# EAGLE design KarasolboxCont (EAGLE 8.1.1)
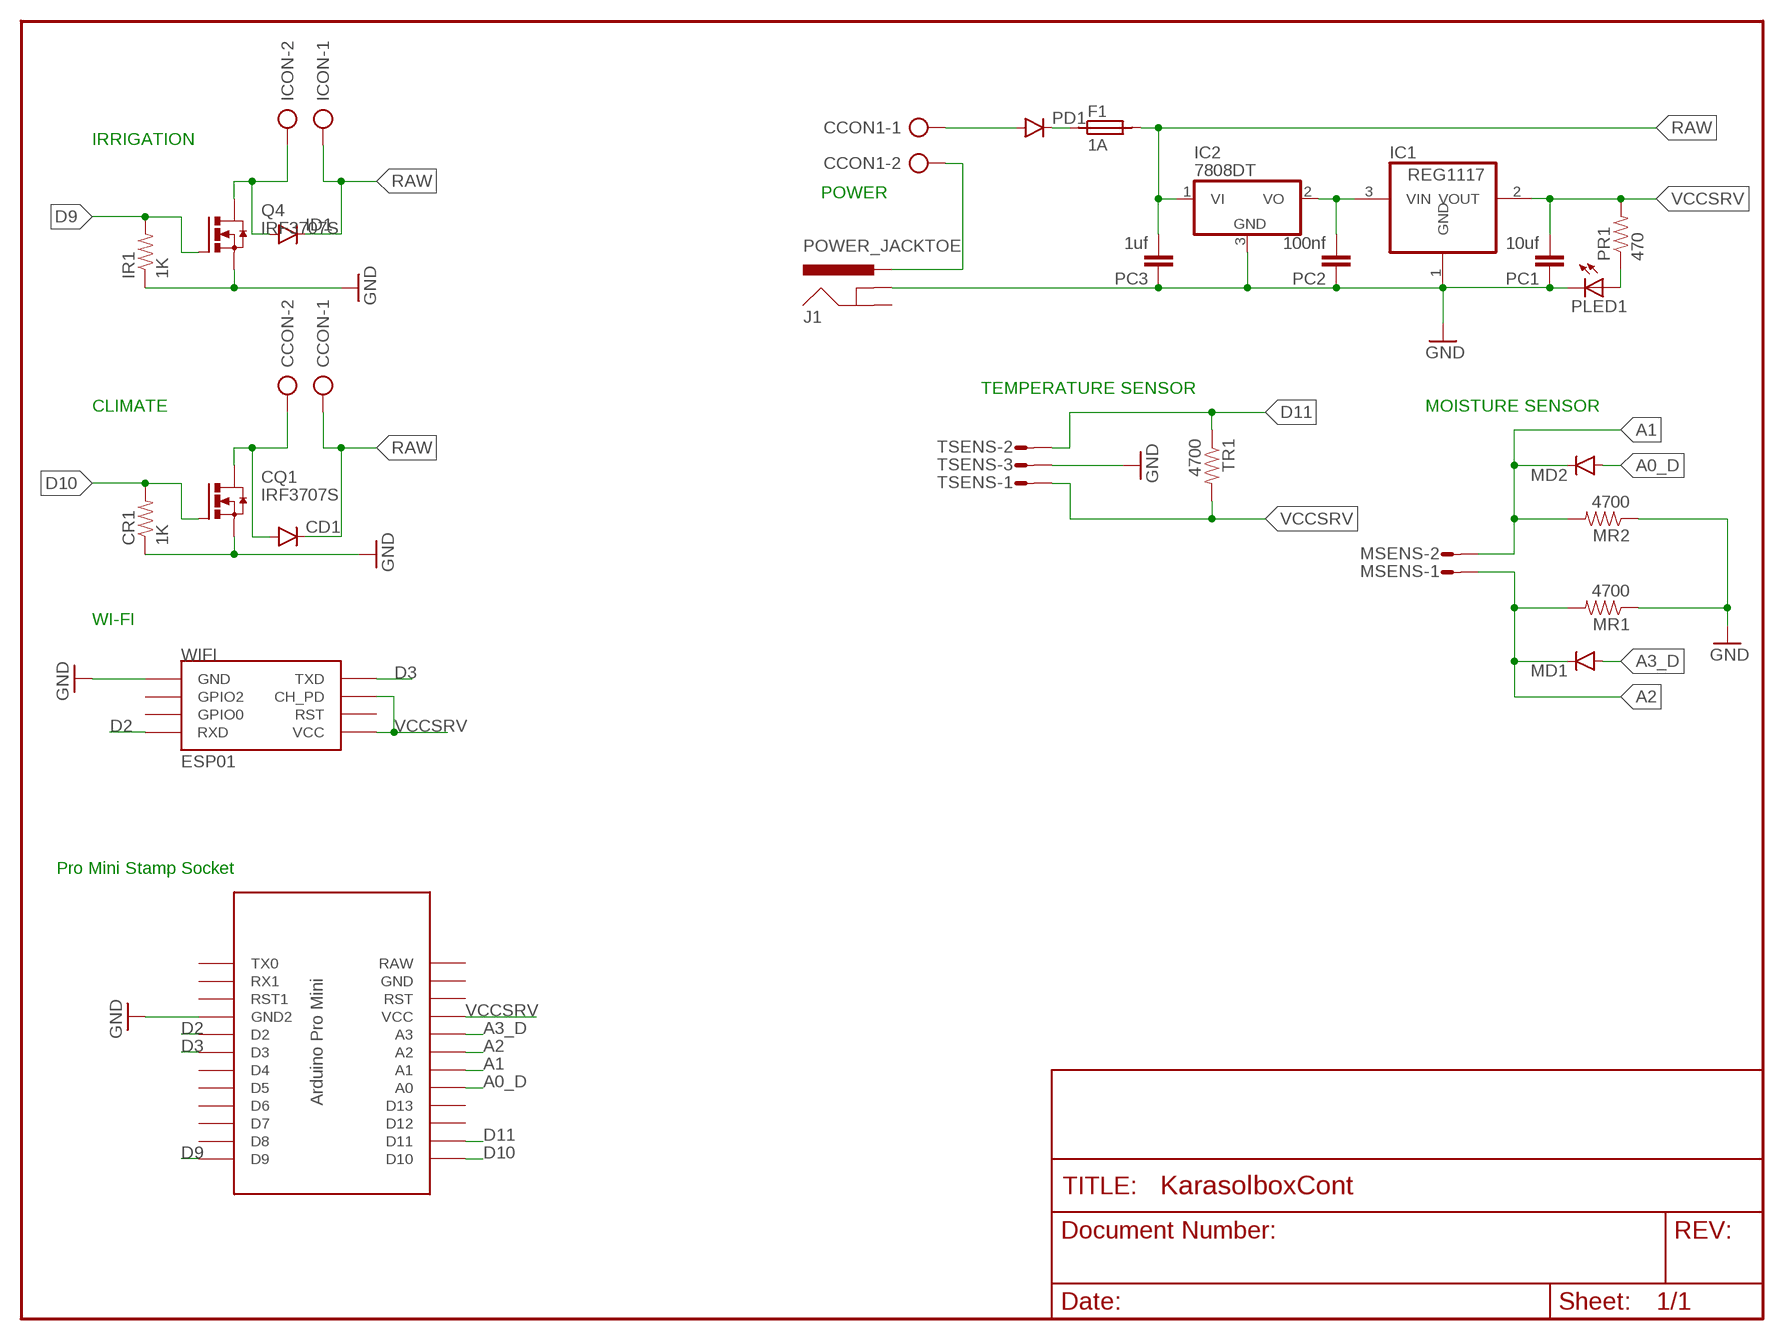
[diagram p0: schematic, sheet 1]

## Parts
CCON  AK300/2  [AK300/2]
CCON1  AK300/2  [AK300/2]
CD1  DIODESMA  [SMA-DIODE]
CQ1  IRF3707S  IRF3704S  [D2PACK]
CR1  1K  RESISTOR0805-RES  [0805]
F1  1A  SIBA194600  [1820]
IC1  REG1117  [SOT223]
IC2  7808DT  [TO252]
ICON  AK300/2  [AK300/2]
ID1  DIODESMA  [SMA-DIODE]
IR1  1K  RESISTOR0805-RES  [0805]
J1  POWER_JACKTOE  [POWER_JACK_SMD_OVERPASTE_TOE]
MD1  DIODESMA  [SMA-DIODE]
MD2  DIODESMA  [SMA-DIODE]
MR1  4700  RESISTOR0805-RES  [0805]
MR2  4700  RESISTOR0805-RES  [0805]
MSENS  S02P  [S02P]
PC1  10uf  CAP0805  [0805]
PC2  100nf  CAP0805  [0805]
PC3  1uf  CAP0805  [0805]
PD1  DIODESMA  [SMA-DIODE]
PLED1  LEDCHIP-LED0805  [CHIP-LED0805]
PR1  470  RESISTOR0805-RES  [0805]
Q4  IRF3707S  IRF3704S  [D2PACK]
TR1  4700  RESISTOR0805-RES  [0805]
TSENS  S03P  [S03P]
U$1  ABK-PRO-MINI  [ABK-PRO-MINI]
WIFI  ESP01  [ESP01]

## Nets
A0_D: MD2.A U$1.A0
A1: MD2.C MR2.2 MSENS.2 U$1.A1
A2: MD1.C MR1.2 MSENS.1 U$1.A2
A3_D: MD1.A U$1.A3
D2: U$1.D2 WIFI.RX(RXD)
D3: U$1.D3 WIFI.TX(TXD)
D9: IR1.2 Q4.1(G) U$1.D9
D10: CQ1.1(G) CR1.2 U$1.D10
D11: TR1.1 TSENS.2 U$1.D11
GND: CQ1.3(S) CR1.1 IC1.1(GND) IC2.3(GND) IR1.1 J1.GND(GNDBREAK) MR1.1 MR2.1 PC1.1 PC2.1 PC3.1 PLED1.C Q4.3(S) TSENS.3 U$1.GND1(GND2) WIFI.GND
N$1: F1.1 PD1.C
N$2: CCON.2 CD1.A CQ1.2(D)
N$3: CCON1.1 PD1.A
N$5: ICON.2 ID1.A Q4.2(D)
N$7: CCON1.2 J1.VIN0(PWR)
N$11: PLED1.A PR1.1
N$12: IC1.3(VIN) IC2.2(VO) PC2.2
RAW [v]: CCON.1 CD1.C F1.2 IC2.1(VI) ICON.1 ID1.C PC3.2
VCCSRV: IC1.2(VOUT) PC1.2 PR1.2 TR1.2 TSENS.1 U$1.VCC WIFI.CH_PD WIFI.VCC
Unconnected: J1.P$4(GND) U$1.D4 U$1.D5 U$1.D6 U$1.D7 U$1.D8 U$1.D12 U$1.D13 U$1.GND U$1.RAW U$1.RST U$1.RST1 U$1.RX1 U$1.TX0 WIFI.GPIO0 WIFI.GPIO2 WIFI.RST

## Notes on the sheet
- IRRIGATION
- POWER
- TEMPERATURE SENSOR
- CLIMATE | MOISTURE SENSOR
- WI-FI
- Pro Mini Stamp Socket

## Library data of the parts
CCON CCON1 ICON = con-ptr500:AK300/2: CONNECTOR; OC_FARNELL: unknown; OC_NEWARK: unknown
CD1 ID1 MD1 MD2 PD1 = SparkFun-DiscreteSemi:DIODE: Diode These are standard reverse protection diodes and small signal diodes. SMA package can handle up to about 1A. SOD-323 can handle about 200mA. What the SOD-323 package when ordering, there are some mfgs out there that are 5-pin packages.
CQ1 Q4 = transistor-power:IRF3704: SMPS MOSFET HEXFET® Power MOSFET Source: http://www.irf.com/product-info/datasheets/data/irf3704.pdf
CR1 IR1 MR1 MR2 PR1 TR1 = SparkFun-Passives:RESISTOR: Resistor Basic schematic elements and footprints for 0603, 1206, and PTH resistors.
F1 = _hhn_PtcFuses_Siba_r500_Ozan:SIBA194600*: SIBA PTC-Fuses, Series 194600, 1812 (4.5 3.2)mm Source: www.siba.de/ Package: SMD 1812 (4.5 x 3.2)mm Technologies: SIBA194600Axxx xxx: Trip-Current * 10 mA Author: Dipl.-Ing. FH Rainer Bayer
IC1 = burr-brown:REG1117: 800mA and 1A Low Dropout (LDO) Positive Regulator 1.8V, 2.5V, 2.85V, 3.3V, 5V, and Adj; MPN: REG1117; OC_FARNELL: 1097566; OC_NEWARK: 14P6981
IC2 = linear:78*: Positive VOLTAGE REGULATOR Source: http://cache.national.com/ds/LM/LM78L05.pdf http://www.fairchildsemi.com/ds/LM/LM7805.pdf
J1 = SparkFun-Connectors:POWER_JACK: Power Jack Connector This is the standard 5.5mm barrel jack for power. The PTH is the most common, proven, reliable, footprint. The Slot footprint only works if the mill layer is transmitted to the PCB fab house so be warned. Here are the connectors we sell at SparkFun: DC Barrel Power Jack/Connector <https://www.sparkfun.com/products/119> (PRT-00119) DC Barrel Power Jack/Connector (SMD) <https://www.sparkfun.com/products/12748> (PRT-12748) DC Barrel Jack Adapter - Breadboard Compatible <https://www.sparkfun.com/products/10811> (PRT-10811) It is used on this SparkFun product (and many, many others): SparkFun RedBoard - Programmed with Arduino <https://www.sparkfun.com/products/12757> (DEV-12757) Also, if you need a mating power supply or connector, please check these out: Wall Adapter Power Supply - 9VDC 650mA <https://www.sparkfun.com/products/298> (TOL-00298) DC Barrel Jack Adapter - Male <https://www.sparkfun.com/products/10287> (PRT-10287); PROD_ID: CONN-08106; SF_ID: PRT-12748
MSENS = con-amp-mt:S02P: AMP MT CONNECTOR; OC_FARNELL: unknown; OC_NEWARK: unknown
PC1-PC3 = SparkFun-Capacitors:CAP: Capacitor Standard 0603 ceramic capacitor, and 0.1" leaded capacitor.
PLED1 = led:LED: LED OSRAM: - CHIPLED LG R971, LG N971, LY N971, LG Q971, LY Q971, LO R971, LY R971 LH N974, LH R974 LS Q976, LO Q976, LY Q976 LO Q996 - Hyper CHIPLED LW Q18S LB Q993, LB Q99A, LB R99A - SideLED LS A670, LO A670, LY A670, LG A670, LP A670 LB A673, LV A673, LT A673, LW A673 LH A674 LY A675 LS A676, LA A676, LO A676, LY A676, LW A676 LS A679, LY A679, LG A679 - Hyper Micro SIDELED® LS Y876, LA Y876, LO Y876, LY Y876 LT Y87S - SmartLED LW L88C, LW L88S LB L89C, LB L89S, LG L890 LS L89K, LO L89K, LY L89K LS L896, LA L896, LO L896, LY L896 - TOPLED LS T670, LO T670, LY T670, LG T670, LP T670 LSG T670, LSP T670, LSY T670, LOP T670, LYG T670 LG T671, LOG T671, LSG T671 LB T673, LV T673, LT T673, LW T673 LH T674 LS T676, LA T676, LO T676, LY T676, LB T676, LH T676, LSB T676, LW T676 LB T67C, LV T67C, LT T67C, LS T67K, LO T67K, LY T67K, LW E67C LS E67B, LA E67B, LO E67B, LY E67B, LB E67C, LV E67C, LT E67C LW T67C LS T679, LY T679, LG T679 LS T770, LO T770, LY T770, LG T770, LP T770 LB T773, LV T773, LT T773, LW T773 LH T774 LS E675, LA E675, LY E675, LS T675 LS T776, LA T776, LO T776, LY T776, LB T776 LHGB T686 LT T68C, LB T68C - Hyper Mini TOPLED® LB M676 - Mini TOPLED Santana® LG M470 LS M47K, LO M47K, LY M47K Source: http://www.osram.convergy.de LUXEON: - LUMILED® LXK2-PW12-R00, LXK2-PW12-S00, LXK2-PW14-U00, LXK2-PW14-V00 LXK2-PM12-R00, LXK2-PM12-S00, LXK2-PM14-U00 LXK2-PE12-Q00, LXK2-PE12-R00, LXK2-PE12-S00, LXK2-PE14-T00, LXK2-PE14-U00 LXK2-PB12-K00, LXK2-PB12-L00, LXK2-PB12-M00, LXK2-PB14-N00, LXK2-PB14-P00, LXK2-PB14-Q00 LXK2-PR12-L00, LXK2-PR12-M00, LXK2-PR14-Q00, LXK2-PR14-R00 LXK2-PD12-Q00, LXK2-PD12-R00, LXK2-PD12-S00 LXK2-PH12-R00, LXK2-PH12-S00 LXK2-PL12-P00, LXK2-PL12-Q00, LXK2-PL12-R00 Source: www.luxeon.com KINGBRIGHT: KA-3528ASYC Source: www.kingbright.com
TSENS = con-amp-mt:S03P: AMP MT CONNECTOR; OC_FARNELL: unknown; OC_NEWARK: unknown
U$1 = Arduino-Clk:ABK-PRO-MINI: ABK Pro-Mini Arduino Clone
WIFI = esp8266modules:ESP01: ESP8266 Wifi module 01

## Net classes
0 default: width 0.3 mm, drill 0.5 mm, clearance 0.25 mm

## Board
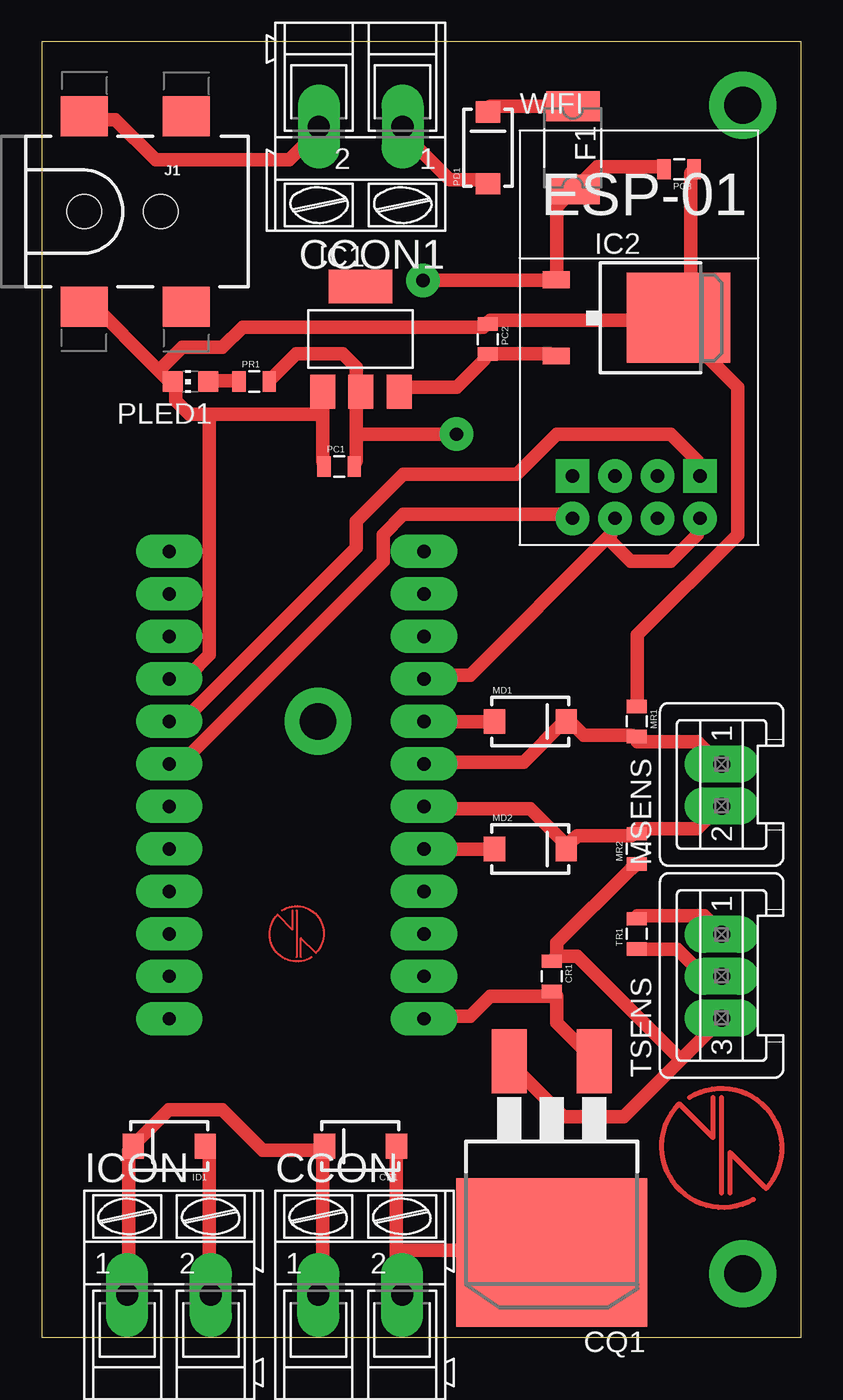
[diagram p1: board, top side]
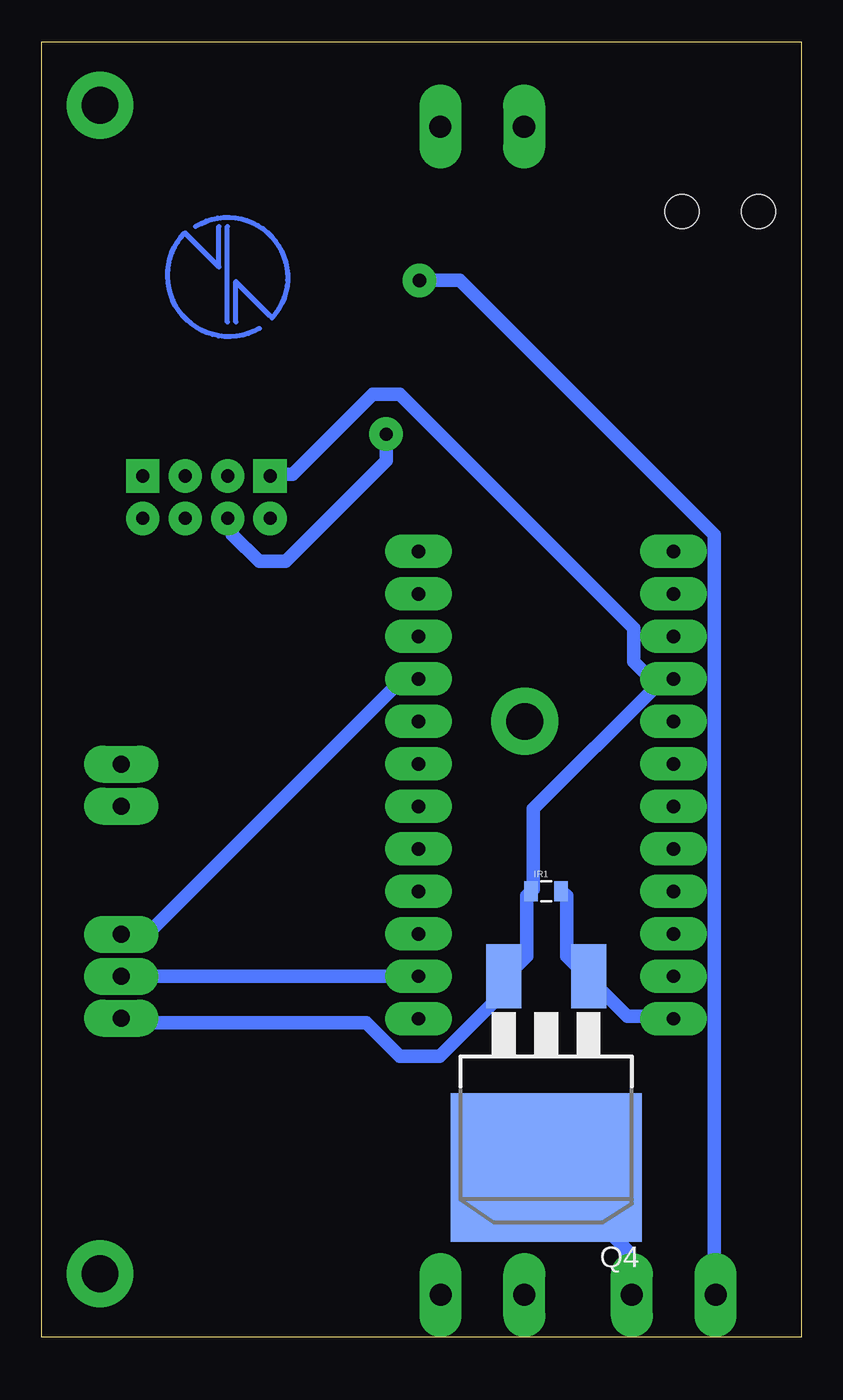
[diagram p2: board, bottom side, seen from below]

Size 45.39 x 77.46 mm. Coordinates in mm from the lower left corner, seen from the top.
Outline: 0,0 45.39,0 45.39,77.46 0,77.46 0,0
Copper layers (1*16): Top 0.035mm / dielectric 1.5mm / Bottom 0.035mm
Design rules "default *": minimum track width 0.8mm, minimum drill 0.8mm, track to track 0.8mm, track to pad 0.8mm, pad to pad 0.45mm, via to via 0.8mm, smd to smd 8mil, copper to edge 40mil, drill to drill 8mil, minimum pad ring 0.6mm, minimum via ring 0.6mm, stop-mask expansion 4mil, vias tented up to drill 0mil, thermal gap 10mil

### Footprints (pad centres in the part's own frame; a part is rotated, then mirrored left to right if it is on the bottom)
AK300/2 = drill 1.321 long: 1 -2.515,0; 2 2.489,0
SMA-DIODE = smd 1.27 x 1.47: A -2.15,0; C 2.15,0
D2PACK = smd 2.083 x 3.81: 1 -2.54,-8.89; 3 2.54,-8.89 | smd 11.43 x 8.89: 2 0,2.54
0805 = smd 0.8 x 1.2: 1 -0.9,0; 2 0.9,0
1820 = smd 1.78 x 3.2: 1 -2.49,0; 2 2.49,0
SOT223 = smd 1.499 x 2.007: 1 -2.261,-3.15; 2 0.025,-3.15; 3 2.311,-3.15 | smd 3.81 x 2.007: 4 0,3.15
TO252 = smd 1 x 1.6: 1 -2.28,-4.8; 2 2.28,-4.8 | smd 5.4 x 6.2: 3 0,2.5
POWER_JACK_SMD_OVERPASTE_TOE = smd 2.8 x 2.4: GND 0,-5.7; P$4 6.1,-5.7; VIN0 0,5.7; VIN1 6.1,5.7 | hole 2.032: 0,0; 4.572,0
S02P = drill 1.016 long: 1 1.25,0; 2 -1.25,0
CHIP-LED0805 = smd 1.2 x 1.2: A 0,-1.05; C 0,1.05
S03P = drill 1.016 long: 1 2.5,0; 2 0,0; 3 -2.5,0
ABK-PRO-MINI = drill 0.8 long: A0 10.16,-11.43; A1 10.16,-8.89; A2 10.16,-6.35; A3 10.16,-3.81; D2 -5.08,-3.81; D3 -5.08,-6.35; D4 -5.08,-8.89; D5 -5.08,-11.43; D6 -5.08,-13.97; D7 -5.08,-16.51; D8 -5.08,-19.05; D9 -5.08,-21.59; D10 10.16,-21.59; D11 10.16,-19.05; D12 10.16,-16.51; D13 10.16,-13.97; GND 10.16,3.81; GND1 -5.08,-1.27; RAW 10.16,6.35; RST 10.16,1.27; RST1 -5.08,1.27; RX1 -5.08,3.81; TX0 -5.08,6.35; VCC 10.16,-1.27
ESP01 = drill 0.8: CH_PD -1.285,-8.178; GPIO0 1.255,-5.638; GPIO2 -1.285,-5.638; RST 1.255,-8.178; TX -3.825,-8.178; VCC 3.795,-8.178 | drill 0.8 square: GND -3.825,-5.638; RX 3.795,-5.638

### Placement (x,y rotation side)
CCON  19.05,2.54 0 top
CCON1  19.05,72.39 180 top
CD1  19.05,11.43 180 top
CQ1  30.48,7.62 180 top
CR1  30.48,21.59 270 top
F1  31.75,71.12 270 top
IC1  19.05,59.69 0 top
IC2  35.56,60.96 270 top
ICON  7.62,2.54 0 top
ID1  7.62,11.43 180 top
IR1  15.24,26.67 0 bottom
J1  2.54,67.31 0 top
MD1  29.21,36.83 0 top
MD2  29.21,29.21 0 top
MR1  35.56,36.83 270 top
MR2  35.56,29.21 90 top
MSENS  40.64,33.02 90 top
PC1  17.78,52.07 0 top
PC2  26.67,59.69 270 top
PC3  38.1,69.85 180 top
PD1  26.67,71.12 90 top
PLED1  8.89,57.15 90 top
PR1  12.7,57.15 0 top
Q4  15.24,12.7 180 bottom
TR1  35.56,24.13 90 top
TSENS  40.64,21.59 90 top
U$1  12.7,40.64 0 top
U$2  [IOTECH_COPPER]  15.24,24.13 0 top
U$3  [IOTECH_COPPER_M]  34.29,63.5 0 bottom
U$4  [IOTECH_COPPER_M]  40.64,11.43 0 top
WIFI  35.56,57.15 0 top

### Tracks (layer width: path | path; a pad name or v marks a point on that pad's centre or on a via)
A0_D
  Top 0.8: MD2.A 26.8,29.2 23.2,29.2 U$1.A0
A1
  Top 0.8: MSENS.2 40.4,31.6 39.2,30.4 35.6,30.4 MR2.2 35.2,30 32,30 31.6,29.6 MD2.C 31.2,29.6 29.2,31.6 23.2,31.6 U$1.A1
A2
  Top 0.8: MSENS.1 40.4,34.4 39.2,35.6 35.6,35.6 MR1.2 35.2,36 32.4,36 31.6,36.8 MD1.C 31.2,36.8 28.8,34.4 23.2,34.4 U$1.A2
A3_D
  Top 0.8: MD1.A 26.8,36.8 23.2,36.8 U$1.A3
D2
  Top 0.8: U$1.D2 8,36.8 8.4,36.8 18.8,47.2 18.8,48.8 21.6,51.6 28.4,51.6 30.8,54 37.6,54 39.2,52.4 39.2,51.6 WIFI.RX
D3
  Top 0.8: U$1.D3 8,34.4 8.4,34.4 20.4,46.4 20.4,48 21.6,49.2 31.6,49.2 WIFI.TX
D9
  Bottom 0.8: IR1.2 14,26.4 14,22.8 12.8,21.6 Q4.1 12.4,21.2 10.4,19.2 8,19.2 U$1.D9
D10
  Top 0.8: CQ1.1 32.8,16.8 30.8,18.8 30.8,20.4 CR1.2 30.4,20.4 26.8,20.4 25.6,19.2 23.2,19.2 U$1.D10
D11
  Top 0.8: TR1.1 35.6,23.2 38,23.2 39.6,21.6 40.4,21.6 TSENS.2
  Bottom 0.8: U$1.D11 23.2,21.6 40.4,21.6 TSENS.2
GND
  Top 0.8: IC2.3 38,60.8 26.8,60.8 PC2.1 26.4,60.4 12,60.4 10.8,59.2 8.4,59.2 7,57.8 | MR1.1 35.6,38 35.6,42 41.6,48 41.6,56.8 38,60.4 IC2.3 | PC3.1 38.8,69.6 38.8,61.6 38.4,61.2 IC2.3 | 30.8,22.8 30.8,23.6 35.2,28 MR2.1 | 30.8,22.8 CR1.1 | 38.2,16.6 40.4,18.8 TSENS.3 | 38.2,16.6 34.8,13.2 31.2,13.2 28,16.4 CQ1.3 | 30.8,22.8 32,22.8 38.2,16.6 | 16.8,55.2 16.8,56.4 IC1.1 | 16.8,55.2 16.8,52.4 PC1.1 | 7,57.8 2.8,62 J1.GND | 7,57.8 7.6,57.2 PLED1.C 8,56.8 8,56 8.8,55.2 10,55.2 | 10,55.2 16.8,55.2 | 10,55.2 10,40.8 8.8,39.6 8,39.6 U$1.GND1
  Bottom 0.8: 8.6,39 16,31.6 16,26.8 IR1.1 16.4,26.4 16.4,22.8 17.6,21.6 Q4.3 18,21.2 18,20.4 21.6,16.8 24,16.8 26,18.8 40.4,18.8 TSENS.3 | 8.6,39 8.4,39.2 8,39.2 U$1.GND1 | 8.6,39 10,40.4 10,42.4 24,56.4 25.6,56.4 30.4,51.6 31.6,51.6 WIFI.GND
N$1
  Top 0.8: PD1.C 26.8,73.6 31.6,73.6 F1.1
N$2
  Top 0.8: 21.2,5.2 21.2,2.8 CCON.2 | 21.2,5.2 CD1.A | 21.2,5.2 30.4,5.2 CQ1.2
N$3
  Top 0.8: PD1.A 26.4,69.2 24.4,69.2 21.6,72 CCON1.1
N$4  (via drill 2.2 pad 4)
  other vias: 16.51,36.83
N$5
  Top 0.8: ID1.A 10,11.2 10,2.8 ICON.2
  Bottom 0.8: ICON.2 10.4,2.8 10.4,5.2 15.2,10 Q4.2
N$7
  Top 0.8: J1.VIN0 2.8,72.8 4.4,72.8 6.8,70.4 14.8,70.4 16.4,72 CCON1.2
N$8  (via drill 2.2 pad 4)
  other vias: 41.91,3.81
N$9  (via drill 2.2 pad 4)
  other vias: 41.91,73.66
N$11
  Top 0.8: PLED1.A 10,57.2 11.6,57.2 PR1.1
N$12
  Top 0.8: IC2.2 30.4,58.8 26.8,58.8 PC2.2 26.4,58.4 24.8,56.8 21.6,56.8 IC1.3
RAW  (via drill 0.8)
  Top 0.8: CCON.1 16.8,2.8 16.8,11.2 CD1.C 16.4,11.2 13.2,11.2 10.8,13.6 7.6,13.6 5.6,11.6 ID1.C 5.2,11.2 5.2,2.8 ICON.1 | PC3.2 37.2,70 33.2,70 32,68.8 F1.2 31.6,68.4 30.8,67.6 30.8,63.6 IC2.1 30.4,63.2 v22.8,63.2
  Bottom 0.8: v22.8,63.2 20.4,63.2 5.2,48 5.2,2.8 ICON.1
VCCSRV  (via drill 0.8)
  Top 0.8: TR1.2 35.6,25.2 39.6,25.2 40.4,24.4 TSENS.1 | PR1.2 13.6,57.2 15.2,58.8 18,58.8 18.8,58 18.8,56.8 IC1.2 18.8,56.4 18.8,54 | 18.8,54 18.8,52.4 PC1.2 | 33.8,47.8 34,48 34,48.8 WIFI.CH_PD | 33.8,47.8 25.6,39.6 23.2,39.6 U$1.VCC | 33.8,47.8 35.2,46.4 37.6,46.4 39.2,48 39.2,48.8 WIFI.VCC | v24.8,54 18.8,54
  Bottom 0.8: v24.8,54 24.8,52.4 30.8,46.4 32.4,46.4 34,48 34,48.8 WIFI.CH_PD | TSENS.1 40.4,24.4 38.8,24.4 24,39.2 23.2,39.2 U$1.VCC